# Altium schematic sheet Mainboard_1.SchDoc
size A; SheetNumber: 1; SheetTotal: 3
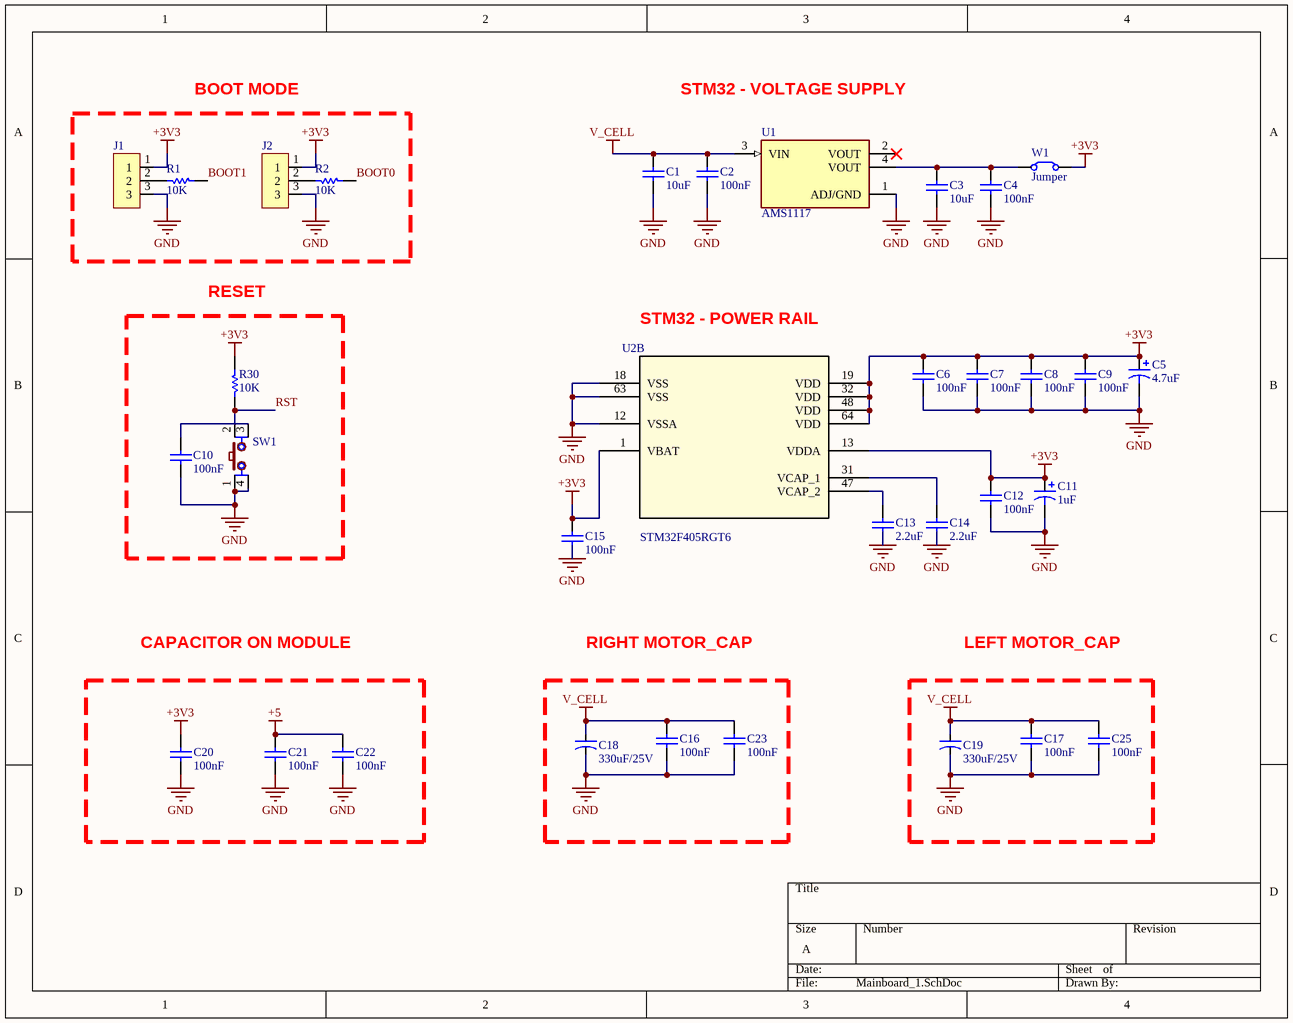
[diagram p0: Mainboard_1.SchDoc]

## Parts
C1  10uF  [C1206]
C2  100nF  [6-0805_M]
C3  10uF  [C1206]
C4  100nF  [6-0805_M]
C5  4.7uF  [C1206]
C6  100nF  [6-0805_M]
C7  100nF  [6-0805_M]
C8  100nF  [6-0805_M]
C9  100nF  [6-0805_M]
C10  100nF  [6-0805_M]
C11  1uF  [C1206]
C12  100nF  [6-0805_M]
C13  2.2uF  [6-0805_M]
C14  2.2uF  [6-0805_M]
C15  100nF  [6-0805_M]
C16  100nF  [6-0805_M]
C17  100nF  [6-0805_M]
C18  330uF/25V  [CAP-ALU-SMD-F]
C19  330uF/25V  [CAP-ALU-SMD-F]
C20  100nF  [6-0805_M]
C21  100nF  [6-0805_M]
C22  100nF  [6-0805_M]
C23  100nF  [6-0805_M]
C25  100nF  [6-0805_M]
J1  3_pin connector  [3_PIN SERVO CONNECTOR]  (value not drawn)
J2  3_pin connector  [3_PIN SERVO CONNECTOR]  (value not drawn)
R1  10K  [6-0805_N]
R2  10K  [6-0805_N]
R30  10K  [6-0805_N]
SW1  SW  [SW2-SMD]  (value not drawn)
U1  AMS1117  [SOT229P700X180-4N]
U2  STM32F405RGT6  [LQFP64-10x10mm]  (part B of 2)
W1  Jumper  [Jumper]

## Blocks framed on the sheet
BOOT MODE: J1 J2 R1 R2
RESET: C10 R30 SW1

## Nets
+3V3: C5.1 C6.1 C7.1 C8.1 C9.1 C11.1 C12.1 C15.1 C20.1 J1.1 J2.1 R30.2 U2.1(VBAT) U2.13(VDDA) U2.19(VDD) U2.32(VDD) U2.48(VDD) U2.64(VDD) W1.2
+5: C21.1 C22.1
GND: C1.2 C2.2 C3.2 C4.2 C5.2 C6.2 C7.2 C8.2 C9.2 C10.2 C11.2 C12.2 C13.2 C14.2 C15.2 C16.2 C17.2 C18.2 C19.2 C20.2 C21.2 C22.2 C23.2 C25.2 J1.3 J2.3 SW1.1 SW1.4 U1.1(ADJ/GND) U2.12(VSSA) U2.18(VSS) U2.63(VSS)
V_CELL: C1.1 C2.1 C16.1 C17.1 C18.1 C19.1 C23.1 C25.1 U1.3(VIN)
BOOT0: R2.2
BOOT1: R1.2
RST: R30.1 SW1.3
NetC3_1: C3.1 C4.1 U1.4(VOUT) W1.1
NetC10_1: C10.1 SW1.2
NetC13_1: C13.1 U2.47(VCAP_2)
NetC14_1: C14.1 U2.31(VCAP_1)
NetJ1_2: J1.2 R1.1
NetJ2_2: J2.2 R2.1

Not connected (* = marked no-connect by the designer): U1 2(VOUT)*

## Notes on the sheet
- STM32 - VOLTAGE SUPPLY
- STM32 - POWER RAIL
- CAPACITOR ON MODULE
- RIGHT MOTOR_CAP
- LEFT MOTOR_CAP

## Library data of the parts
C1-C4 C6-C10 C12-C17 C20-C23 C25 = Cap: Capacitor; Published: 8-Jun-2000; LatestRevisionDate: 17-Jul-2002; LatestRevisionNote: Re-released for DXP Platform.; PackageReference: RAD-0.3; Publisher: Altium Limited; PackageDescription: Radial Cap, Thru-Hole; 2 Leads; 0.3 in Pin Spacing
C5 C11 = Cap Pol1: Polarized Capacitor (Radial); Published: 8-Jun-2000; LatestRevisionDate: 17-Jul-2002; LatestRevisionNote: Re-released for DXP Platform.; PackageReference: RB7.6-15; Publisher: Altium Limited; PackageDescription: Polarized Capacitor (Radial); 2 Leads
  C5: Value: 4.7uF
  C11: Value: 1uF
C18 C19 = CN-ALU-DIP: Capacitor (Semiconductor SIM Model); Value: 104; LatestRevisionDate: 17-Jul-2002; LatestRevisionNote: Re-released for DXP Platform.; PackageReference: C1206; Publisher: Altium Limited
J1 J2 = 3_pin connector: Boot using for stm32
R1 R2 R30 = Res1: Resistor; Published: 8-Jun-2000; LatestRevisionDate: 17-Jul-2002; LatestRevisionNote: Re-released for DXP Platform.; PackageReference: AXIAL-0.3; Publisher: Altium Limited; PackageDescription: Axial Device, Thru-Hole; 2 Leads; 0.3 in Pin Spacing; Value: 10K
SW1 = SW4: Switch button 4 pin; Value: Button chip 4 pin
U1 = AMS1117: 1A LOW DROPOUT VOLTAGE REGULATOR SOT-223; MF: Advanced Monolithic Systems; SnapEDA_Link: https://www.snapeda.com/parts/AMS1117/Advanced+Monolithic+Systems/view-part/?ref=snap; Package: SOT-223 Seeed Technology; Value: *; MP: AMS1117; Check_prices: https://www.snapeda.com/parts/AMS1117/Advanced+Monolithic+Systems/view-part/?ref=eda
U2 = STM32F405RGT6: High-performance foundation line, Arm Cortex-M4 core with DSP and FPU, 1 Mbyte of Flash memory, 168 MHz CPU, ART Accelerator; Manufacturer_Name: STMicroelectronics; Copyright: Copyright (C) 2025 Ultra Librarian. All rights reserved.; Manufacturer_Part_Number: STM32F405RGT6; Datasheet: https://www.st.com/resource/en/datasheet/stm32f405rg.pdf; RefDes: RefDes; Type: Type